# EAGLE schematic ArduinoLundin (EAGLE 6.4)
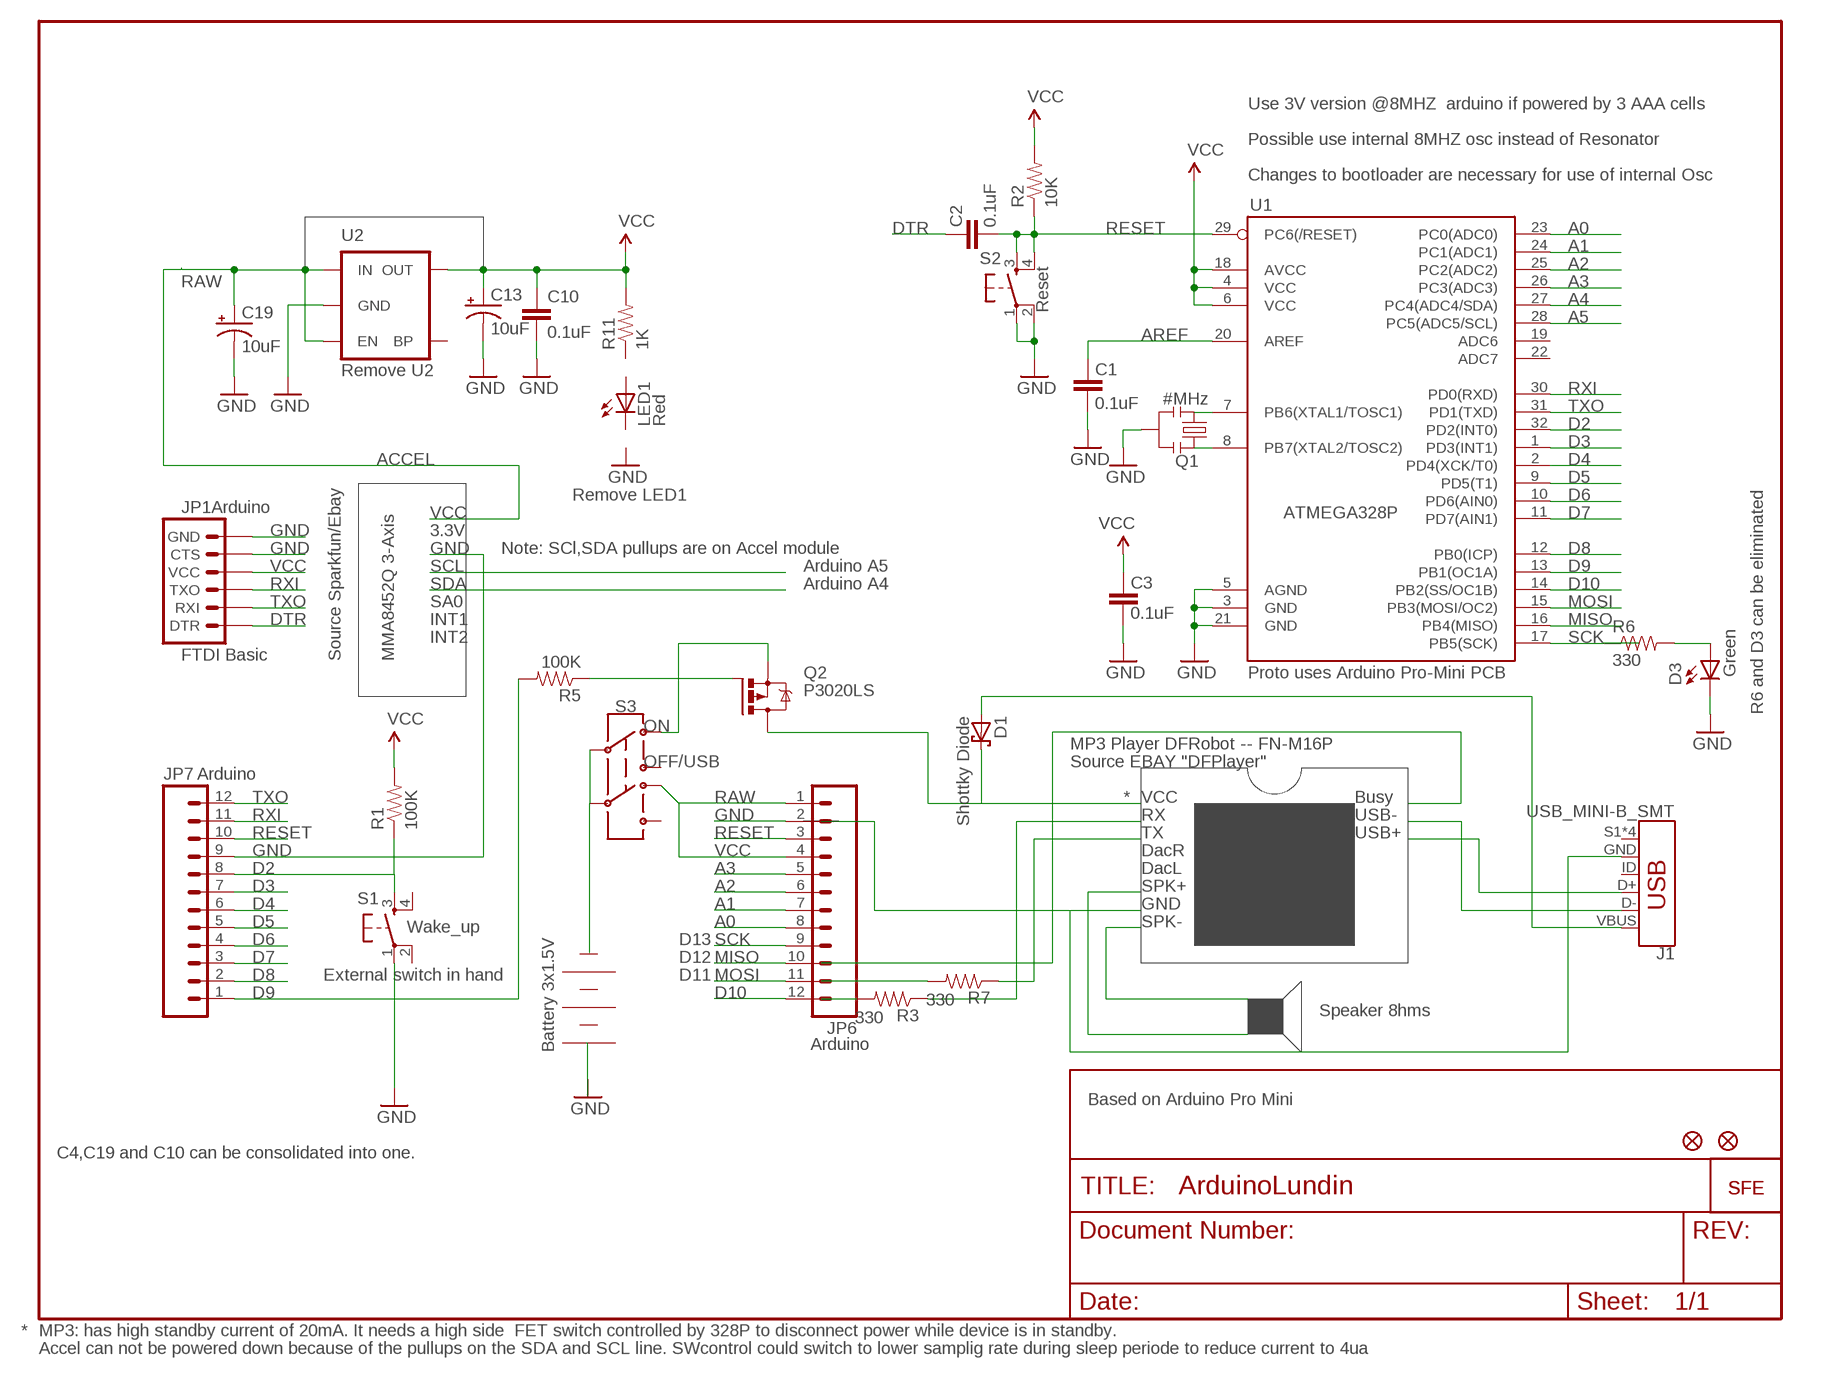
[diagram p0: schematic, sheet 1]

## Parts
C1  0.1uF  CAP0402  [C0402]
C2  0.1uF  CAP0402  [C0402]
C3  0.1uF  CAP0402  [C0402]
C10  0.1uF  CAP0402  [C0402]
C13  10uF  CAP_POL1206  [EIA3216]
C19  10uF  CAP_POL1206  [EIA3216]
D1  Shottky Diode  BAS40  [SOT23]
D3  Green  LED0603  [LED-0603]
J1  USB_MINI-B_SMT  [USB-MINIB]
JP1  FTDI Basic  ARDUINO_SERIAL_PROGRAMPTH  [1X06]
JP6  M12PTH  [1X12]
JP7  M12PTH  [1X12]
LED1  Red  LED0603  [LED-0603]
Q1  #MHz  RESONATORSMD  [RESONATOR-SMD]
Q2  P3020LS  IRFR5305  [D-PAK_TO252AA]
R1  100K  RESISTOR0402  [C0402]
R2  10K  RESISTOR0402  [C0402]
R3  330  RESISTOR0402  [C0402]
R5  100K  RESISTOR0402  [C0402]
R6  330  RESISTOR0402  [C0402]
R7  330  RESISTOR0402  [C0402]
R11  1K  RESISTOR0402  [C0402]
S1  Wake_up  TAC_SWITCHSND  [TACTILE_SWITCH_SMD]
S2  Reset  TAC_SWITCHSND  [TACTILE_SWITCH_SMD]
S3  SWITCH-DPDT-SMD-AYZ0202  [SWITCH_DPDT_SMD_AYZ0202]
U1  ATMEGA168#  ATMEGA168  [TQFP32-08]
U2  ###V  V_REG_LDOSMD  [SOT23-5]
U$1  LOGO-SFESK  [SFE-LOGO-FLAME]
U$2  FIDUCIAL1X2  [FIDUCIAL-1X2]
U$4  FIDUCIAL1X2  [FIDUCIAL-1X2]
U$11  LOGO-SFENEW  [SFE-NEW-WEBLOGO]

## Nets
3.3V: R1.2 ; supply symbol labelled VCC
A0: JP6.8 U1.23(PC0(ADC0))
A1: JP6.7 U1.24(PC1(ADC1))
A2: JP6.6 U1.25(PC2(ADC2))
A3: JP6.5 U1.26(PC3(ADC3))
A4: U1.27(PC4(ADC4/SDA))
A5: U1.28(PC5(ADC5/SCL))
AREF: C1.2 U1.20(AREF)
D2: JP7.8 R1.1 S1.3 U1.32(PD2(INT0))
D3: JP7.7 U1.1(PD3(INT1))
D4: JP7.6 U1.2(PD4(XCK/T0))
D5: JP7.5 U1.9(PD5(T1))
D6: JP7.4 U1.10(PD6(AIN0))
D7: JP7.3 U1.11(PD7(AIN1))
D8: JP7.2 U1.12(PB0(ICP))
D9: JP7.1 R5.2 U1.13(PB1(OC1A))
D10: JP6.12 U1.14(PB2(SS/OC1B))
DTR: C2.2 JP1.1(DTR)
GND [vcc]: C1.1 C3.1 C10.2 C13.C(-) C19.C(-) D3.C JP1.5(CTS) JP1.6(GND) JP6.2 JP7.9 Q1.2 S1.1 S2.1 S2.2 U1.3(GND) U1.5(AGND) U1.21(GND) U2.2(GND)
MISO: JP6.10 U1.16(PB4(MISO))
MOSI: JP6.11 U1.15(PB3(MOSI/OC2))
N$1: Q1.1 U1.8(PB7(XTAL2/TOSC2))
N$2: Q1.3 U1.7(PB6(XTAL1/TOSC1))
N$3: Q2.1(G) R5.1
N$5: R3.2
N$7: D3.A R6.2
N$9: J1.GND
N$11: D1.1(A) J1.VBUS
N$12: R3.1
N$15: C19.A(+) U2.1(IN) U2.3(EN)
N$16: S3.2 S3.5
N$17: R7.1
N$18: J1.D-
N$19: J1.D+
N$20: R7.2
N$22: Q2.3(S) S3.1
RAW [vcc]: JP6.1 JP6.4 S3.4
RESET: C2.1 JP6.3 JP7.10 R2.1 S2.3 S2.4 U1.29(PC6(/RESET))
RXI: JP1.3(TXO) JP7.11 U1.30(PD0(RXD))
SCK: JP6.9 R6.1 U1.17(PB5(SCK))
TXO: JP1.2(RXI) JP7.12 U1.31(PD1(TXD))
VCC: C3.2 C10.1 C13.A(+) D1.3(C) JP1.4(VCC) Q2.4(D) R2.2 R11.2 U1.4(VCC) U1.6(VCC) U1.18(AVCC) U2.5(OUT)
Unconnected: J1.ID J1.S1(SHIELD) J1.S2(SHIELD) J1.S3(SHIELD) J1.S4(SHIELD) LED1.A LED1.C R11.1 S1.2 S1.4 S3.3 S3.6 U1.19(ADC6) U1.22(ADC7) U2.4(BP)

## Notes on the sheet
- Use 3V version @8MHZ  arduino if powered by 3 AAA cells
- Possible use internal 8MHZ osc instead of Resonator
- Changes to bootloader are necessary for use of internal Osc
- RAW
- Remove U2
- ACCEL
- Remove LED1
- Arduino
- VCC | ATMEGA328P
- 3.3V
- GND | Note: SCl,SDA pullups are on Accel module
- SCL | Arduino A5
- SDA | Arduino A4
- SA0
- INT1
- INT2
- Source Sparkfun/Ebay | MMA8452Q 3-Axis
- Proto uses Arduino Pro-Mini PCB
- R6 and D3 can be eliminated
- ON
- MP3 Player DFRobot -- FN-M16P
- OFF/USB | Source EBAY "DFPlayer"
- Arduino
- * | VCC | Busy
- RX | USB-
- TX | USB+
- VCC | DacR
- DacL
- SPK+
- GND
- SPK-
- D13
- D12
- External switch in hand | D11
- Speaker 8hms
- Battery 3x1.5V | Arduino
- Based on Arduino Pro Mini
- C4,C19 and C10 can be consolidated into one.
- * | MP3: has high standby current of 20mA. It needs a high side  FET switch controlled by 328P to disconnect power while device is in standby.
- Accel can not be powered down because of the pullups on the SDA and SCL line. SWcontrol could switch to lower samplig rate during sleep periode to reduce current to 4ua

## Library data of the parts
C1-C3 C10 = SparkFun:CAP: Capacitor Standard 0603 ceramic capacitor, and 0.1" leaded capacitor.
C13 C19 = SparkFun:CAP_POL: Capacitor Polarized These are standard SMD and PTH capacitors. Normally 10uF, 47uF, and 100uF in electrolytic and tantalum varieties. Always verify the external diameter of the through hole cap, it varies with capacity, voltage, and manufacturer. The EIA devices should be standard.
D1 = diode:BAS40: Silicon Schottky Diodes General-purpose diode for high-speed switching
D3 LED1 = SparkFun:LED: LEDs Standard schematic elements and footprints for 5mm, 3mm, 1206, and 0603 sized LEDs. 5mm - Spark Fun Electronics SKU : COM-00529 (and others)
J1 = SparkFun-Connectors:USB_MINI-B: USB type Mini-B Connector Breaks out 5th pin, and includes shield pins if needed. SparkFun Products: SparkFun FTDI Basic Breakout <https://www.sparkfun.com/products/9716> SparkFun XBee Explorer USB <https://www.sparkfun.com/products/11812> SparkFun Redboard <https://www.sparkfun.com/products/12757>; PROD_ID: CONN-08193; SF_ID: PRT-00587
JP1 = SparkFun:ARDUINO_SERIAL_PROGRAM
JP6 JP7 = SparkFun:M12: Header 12 Standard 12-pin 0.1" header. Use with straight break away headers (SKU : PRT-00116), right angle break away headers (PRT-00553), swiss pins (PRT-00743), machine pins (PRT-00117), and female headers (PRT-00115).
Q1 = SparkFun:RESONATOR: Resonator Small SMD resonator. This is the itty bitty 10/20MHz resonators with built in caps. CSTCE10M0G55 and CSTCE20M0V53. Footprint has been reviewed closely but hasn't been tested yet.
Q2 = transistor-power:IRF?5305: HEXFET Power MOSFET Source: http://www.irf.com/product-info/datasheets/data/irfr5305pbf.pdf
R1-R3 R5-R7 R11 = SparkFun:RESISTOR: Resistor Basic schematic elements and footprints for 0603, 1206, and PTH 1/10th watt (small) resistors.
S1 S2 = SparkFun:TAC_SWITCH: Momentary Switch Button commonly used for reset or general input. Spark Fun Electronics SKU : COM-00097
S3 = SparkFun-Switches:SWITCH-DPDT: Double-Pole, Double-Throw (DPDT) Switch Double-pole, double-throw switches. Variant Overview PTH-GPI-152-3013 Used on SparkFun Geiger Counter <https://www.sparkfun.com/products/11345> SMD-AY0202 Surface Mount DPDT Switch <https://www.sparkfun.com/products/597> (COM-00597) Used on e.g. LilyPad Arduino USB - ATmega32U4 Board <https://www.sparkfun.com/products/12049>; PROD_ID: SWCH-08179; SF_SKU: COM-00597
U1 = SparkFun:ATMEGA168
U2 = SparkFun:V_REG_LDO: Voltage Regulator LDO Standard 150mA LDO voltage regulator in SOT-23 layout. Micrel part MIC5205. BP (by-pass) pin is used to lower output noise with 470pF cap.
U$1 U$11 = SparkFun:LOGO-SFE: Spark Fun Electronics PCB Logo This is the standard Spark Fun Electronics PCB logo.
U$2 U$4 = SparkFun:FIDUCIAL: Fiducial Alignment Points Various fiducial points for machine vision alignment.

## Net classes
0 default: width 0.203 mm
1 vcc: width 0.254 mm